# Altium project FPGA_interface.PrjPcb
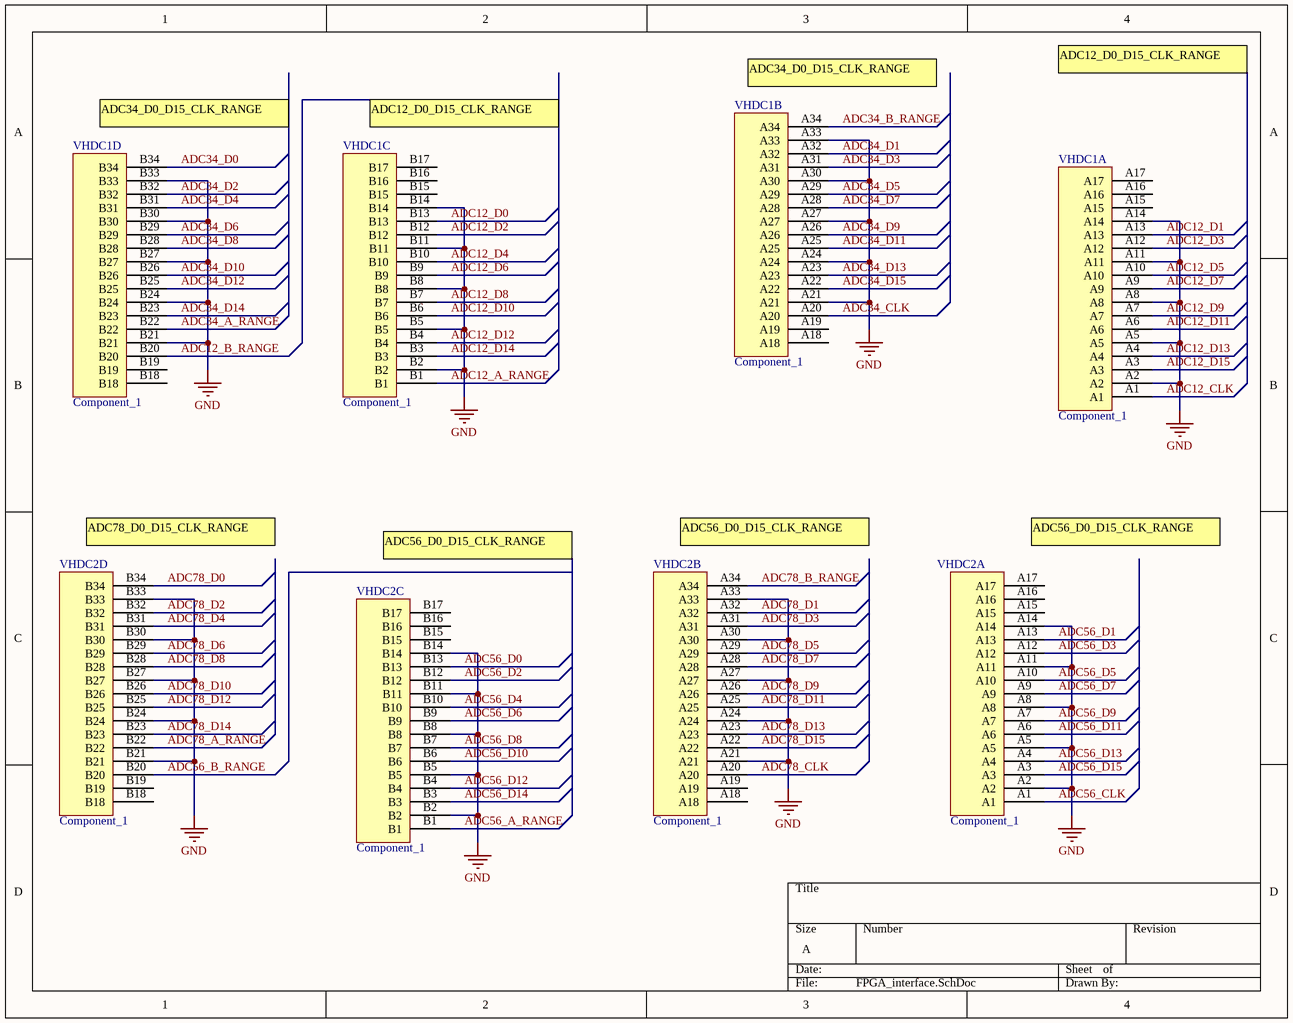
[diagram p0: FPGA_interface.SchDoc]
5 sheets, 18 parts. Net scope: global (net labels, ports and power ports of the same name join across sheets).
Board file: FPGA_interface_ver2.PcbDoc
Sheets:
  FPGA_interface.SchDoc
  Ch1and2.SchDoc
  Ch3and4.SchDoc
  Ch5and6.SchDoc
  Ch7and8.SchDoc

## Sheet FPGA_interface.SchDoc
size A

### Parts
VHDC1  Component_1  [VHDCP-68-01-M-EM: PLUG]  (parts A,B,C,D of 4)
VHDC2  Component_1  [VHDCP-68-01-M-EM: PLUG]  (parts A,B,C,D of 4)

### Nets
GND: VHDC1.A2 VHDC1.A5 VHDC1.A8 VHDC1.A11 VHDC1.A14 VHDC1.A21 VHDC1.A24 VHDC1.A27 VHDC1.A30 VHDC1.A33 VHDC1.B2 VHDC1.B5 VHDC1.B8 VHDC1.B11 VHDC1.B14 VHDC1.B21 VHDC1.B24 VHDC1.B27 VHDC1.B30 VHDC1.B33 VHDC2.A2 VHDC2.A5 VHDC2.A8 VHDC2.A11 VHDC2.A14 VHDC2.A21 VHDC2.A24 VHDC2.A27 VHDC2.A30 VHDC2.A33 VHDC2.B2 VHDC2.B5 VHDC2.B8 VHDC2.B11 VHDC2.B14 VHDC2.B21 VHDC2.B24 VHDC2.B27 VHDC2.B30 VHDC2.B33
ADC12_A_RANGE: VHDC1.B1
ADC12_B_RANGE: VHDC1.B20
ADC12_CLK: VHDC1.A1
ADC12_D0: VHDC1.B13
ADC12_D1: VHDC1.A13
ADC12_D2: VHDC1.B12
ADC12_D3: VHDC1.A12
ADC12_D4: VHDC1.B10
ADC12_D5: VHDC1.A10
ADC12_D6: VHDC1.B9
ADC12_D7: VHDC1.A9
ADC12_D8: VHDC1.B7
ADC12_D9: VHDC1.A7
ADC12_D10: VHDC1.B6
ADC12_D11: VHDC1.A6
ADC12_D12: VHDC1.B4
ADC12_D13: VHDC1.A4
ADC12_D14: VHDC1.B3
ADC12_D15: VHDC1.A3
ADC34_A_RANGE: VHDC1.B22
ADC34_B_RANGE: VHDC1.A34
ADC34_CLK: VHDC1.A20
ADC34_D0: VHDC1.B34
ADC34_D1: VHDC1.A32
ADC34_D2: VHDC1.B32
ADC34_D3: VHDC1.A31
ADC34_D4: VHDC1.B31
ADC34_D5: VHDC1.A29
ADC34_D6: VHDC1.B29
ADC34_D7: VHDC1.A28
ADC34_D8: VHDC1.B28
ADC34_D9: VHDC1.A26
ADC34_D10: VHDC1.B26
ADC34_D11: VHDC1.A25
ADC34_D12: VHDC1.B25
ADC34_D13: VHDC1.A23
ADC34_D14: VHDC1.B23
ADC34_D15: VHDC1.A22
ADC56_A_RANGE: VHDC2.B1
ADC56_B_RANGE: VHDC2.B20
ADC56_CLK: VHDC2.A1
ADC56_D0: VHDC2.B13
ADC56_D1: VHDC2.A13
ADC56_D2: VHDC2.B12
ADC56_D3: VHDC2.A12
ADC56_D4: VHDC2.B10
ADC56_D5: VHDC2.A10
ADC56_D6: VHDC2.B9
ADC56_D7: VHDC2.A9
ADC56_D8: VHDC2.B7
ADC56_D9: VHDC2.A7
ADC56_D10: VHDC2.B6
ADC56_D11: VHDC2.A6
ADC56_D12: VHDC2.B4
ADC56_D13: VHDC2.A4
ADC56_D14: VHDC2.B3
ADC56_D15: VHDC2.A3
ADC78_A_RANGE: VHDC2.B22
ADC78_B_RANGE: VHDC2.A34
ADC78_CLK: VHDC2.A20
ADC78_D0: VHDC2.B34
ADC78_D1: VHDC2.A32
ADC78_D2: VHDC2.B32
ADC78_D3: VHDC2.A31
ADC78_D4: VHDC2.B31
ADC78_D5: VHDC2.A29
ADC78_D6: VHDC2.B29
ADC78_D7: VHDC2.A28
ADC78_D8: VHDC2.B28
ADC78_D9: VHDC2.A26
ADC78_D10: VHDC2.B26
ADC78_D11: VHDC2.A25
ADC78_D12: VHDC2.B25
ADC78_D13: VHDC2.A23
ADC78_D14: VHDC2.B23
ADC78_D15: VHDC2.A22

Not connected (* = marked no-connect by the designer): VHDC1 A15 A16 A17 A18 A19 B15 B16 B17 B18 B19; VHDC2 A15 A16 A17 A18 A19 B15 B16 B17 B18 B19

### Notes on the sheet
- (near VHDC1) ADC34_D0_D15_CLK_RANGE
- ADC12_D0_D15_CLK_RANGE
- (near VHDC1) ADC12_D0_D15_CLK_RANGE
- (near VHDC2) ADC78_D0_D15_CLK_RANGE
- ADC56_D0_D15_CLK_RANGE
- (near VHDC2) ADC56_D0_D15_CLK_RANGE

### Library data of the parts
VHDC1 VHDC2 = Component_1: VHDC_connector

## Sheet Ch1and2.SchDoc
size A
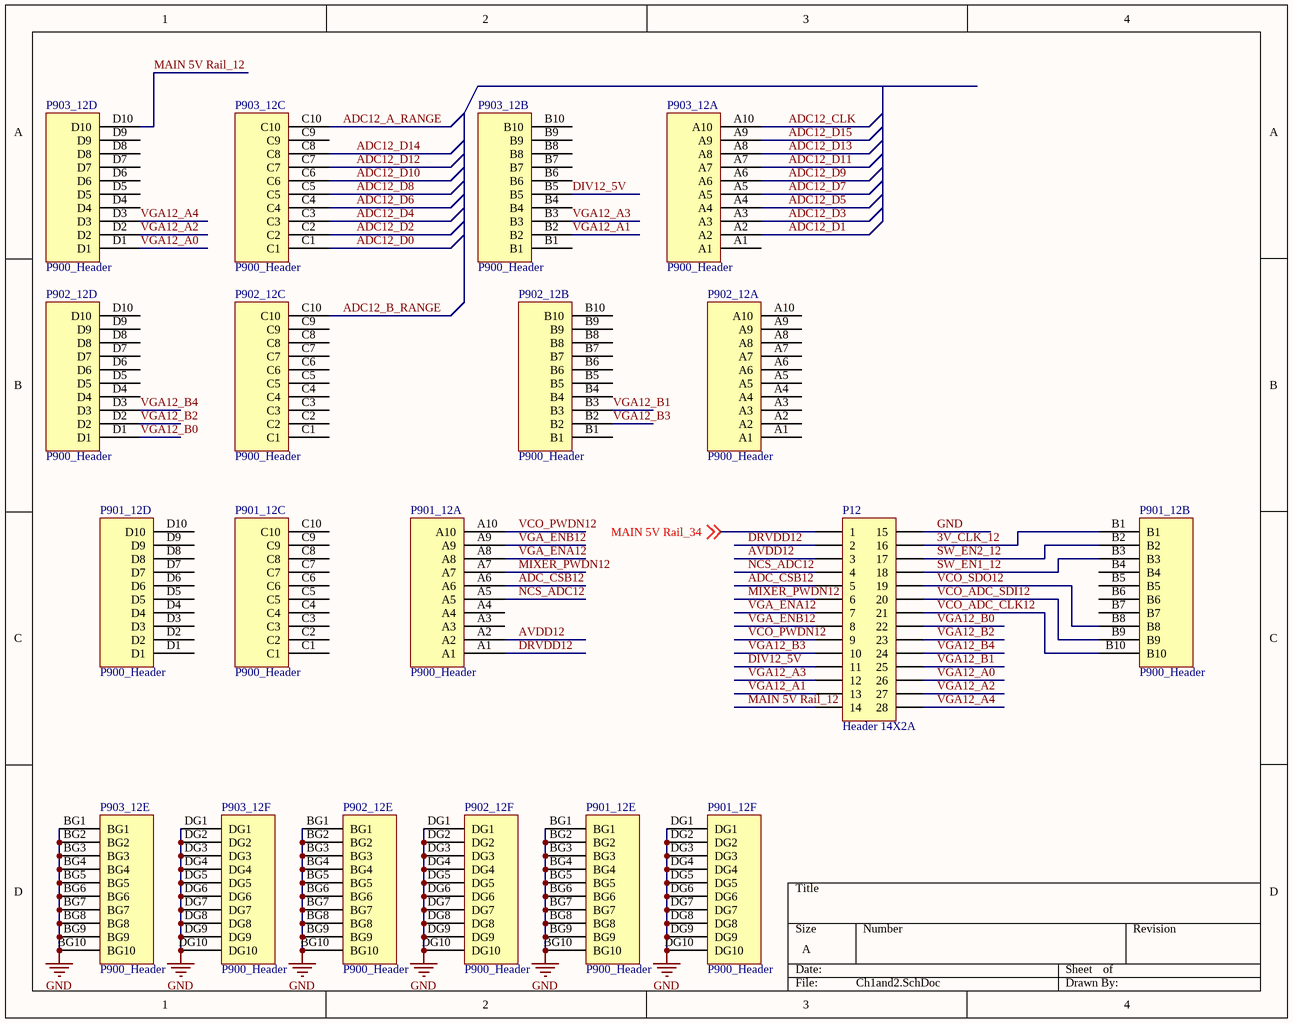
[diagram p1: Ch1and2.SchDoc]

### Parts
P12  Header 14X2A  [HDR2X14_CEN]
P901_12  P900_Header  [P900_header]  (parts A,B,C,D,E,F of 6)
P902_12  P900_Header  [P900_header]  (parts A,B,C,D,E,F of 6)
P903_12  P900_Header  [P900_header]  (parts A,B,C,D,E,F of 6)

### Nets
GND: P12.15 P901_12.BG1 P901_12.BG2 P901_12.BG3 P901_12.BG4 P901_12.BG5 P901_12.BG6 P901_12.BG7 P901_12.BG8 P901_12.BG9 P901_12.BG10 P901_12.DG1 P901_12.DG2 P901_12.DG3 P901_12.DG4 P901_12.DG5 P901_12.DG6 P901_12.DG7 P901_12.DG8 P901_12.DG9 P901_12.DG10 P902_12.BG1 P902_12.BG2 P902_12.BG3 P902_12.BG4 P902_12.BG5 P902_12.BG6 P902_12.BG7 P902_12.BG8 P902_12.BG9 P902_12.BG10 P902_12.DG1 P902_12.DG2 P902_12.DG3 P902_12.DG4 P902_12.DG5 P902_12.DG6 P902_12.DG7 P902_12.DG8 P902_12.DG9 P902_12.DG10 P903_12.BG1 P903_12.BG2 P903_12.BG3 P903_12.BG4 P903_12.BG5 P903_12.BG6 P903_12.BG7 P903_12.BG8 P903_12.BG9 P903_12.BG10 P903_12.DG1 P903_12.DG2 P903_12.DG3 P903_12.DG4 P903_12.DG5 P903_12.DG6 P903_12.DG7 P903_12.DG8 P903_12.DG9 P903_12.DG10
3V_CLK_12: P12.16 P901_12.B1
ADC12_A_RANGE: P903_12.C10
ADC12_B_RANGE: P902_12.C10
ADC12_CLK: P903_12.A10
ADC12_D0: P903_12.C1
ADC12_D1: P903_12.A2
ADC12_D2: P903_12.C2
ADC12_D3: P903_12.A3
ADC12_D4: P903_12.C3
ADC12_D5: P903_12.A4
ADC12_D6: P903_12.C4
ADC12_D7: P903_12.A5
ADC12_D8: P903_12.C5
ADC12_D9: P903_12.A6
ADC12_D10: P903_12.C6
ADC12_D11: P903_12.A7
ADC12_D12: P903_12.C7
ADC12_D13: P903_12.A8
ADC12_D14: P903_12.C8
ADC12_D15: P903_12.A9
ADC_CSB12: P12.5 P901_12.A6
AVDD12: P12.3 P901_12.A2
DIV12_5V: P12.11 P903_12.B5
DRVDD12: P12.2 P901_12.A1
MAIN 5V Rail_12: P12.14 P903_12.D10
MAIN 5V Rail_34: P12.1 ; off-sheet MAIN 5V Rail_34
MIXER_PWDN12: P12.6 P901_12.A7
NCS_ADC12: P12.4 P901_12.A5
SW_EN1_12: P12.18 P901_12.B3
SW_EN2_12: P12.17 P901_12.B2
VCO_ADC_CLK12: P12.21 P901_12.B10
VCO_ADC_SDI12: P12.20 P901_12.B9
VCO_PWDN12: P12.9 P901_12.A10
VCO_SDO12: P12.19 P901_12.B8
VGA12_A0: P12.26 P903_12.D1
VGA12_A1: P12.13 P903_12.B2
VGA12_A2: P12.27 P903_12.D2
VGA12_A3: P12.12 P903_12.B3
VGA12_A4: P12.28 P903_12.D3
VGA12_B0: P12.22 P902_12.D1
VGA12_B1: P12.25 P902_12.B3
VGA12_B2: P12.23 P902_12.D2
VGA12_B3: P12.10 P902_12.B2
VGA12_B4: P12.24 P902_12.D3
VGA_ENA12: P12.7 P901_12.A8
VGA_ENB12: P12.8 P901_12.A9

Not connected (* = marked no-connect by the designer): P901_12 A3 A4 B4 B5 B6 B7 C1 C2 C3 C4 C5 C6 C7 C8 C9 C10 D1 D2 D3 D4 D5 D6 D7 D8 D9 D10; P902_12 A1 A2 A3 A4 A5 A6 A7 A8 A9 A10 B1 B4 B5 B6 B7 B8 B9 B10 C1 C2 C3 C4 C5 C6 C7 C8 C9 D4 D5 D6 D7 D8 D9 D10; P903_12 A1 B1 B4 B6 B7 B8 B9 B10 C9 D4 D5 D6 D7 D8 D9

### Library data of the parts
P12 = Header 14X2A: Header, 14-Pin, Dual row; LatestRevisionDate: 17-Jul-2002; LatestRevisionNote: Re-released for DXP Platform.; Publisher: Altium Limited
P902_12 P903_12 = P900_Header: pin to pad: A1>ADC

## Sheet Ch3and4.SchDoc
size A
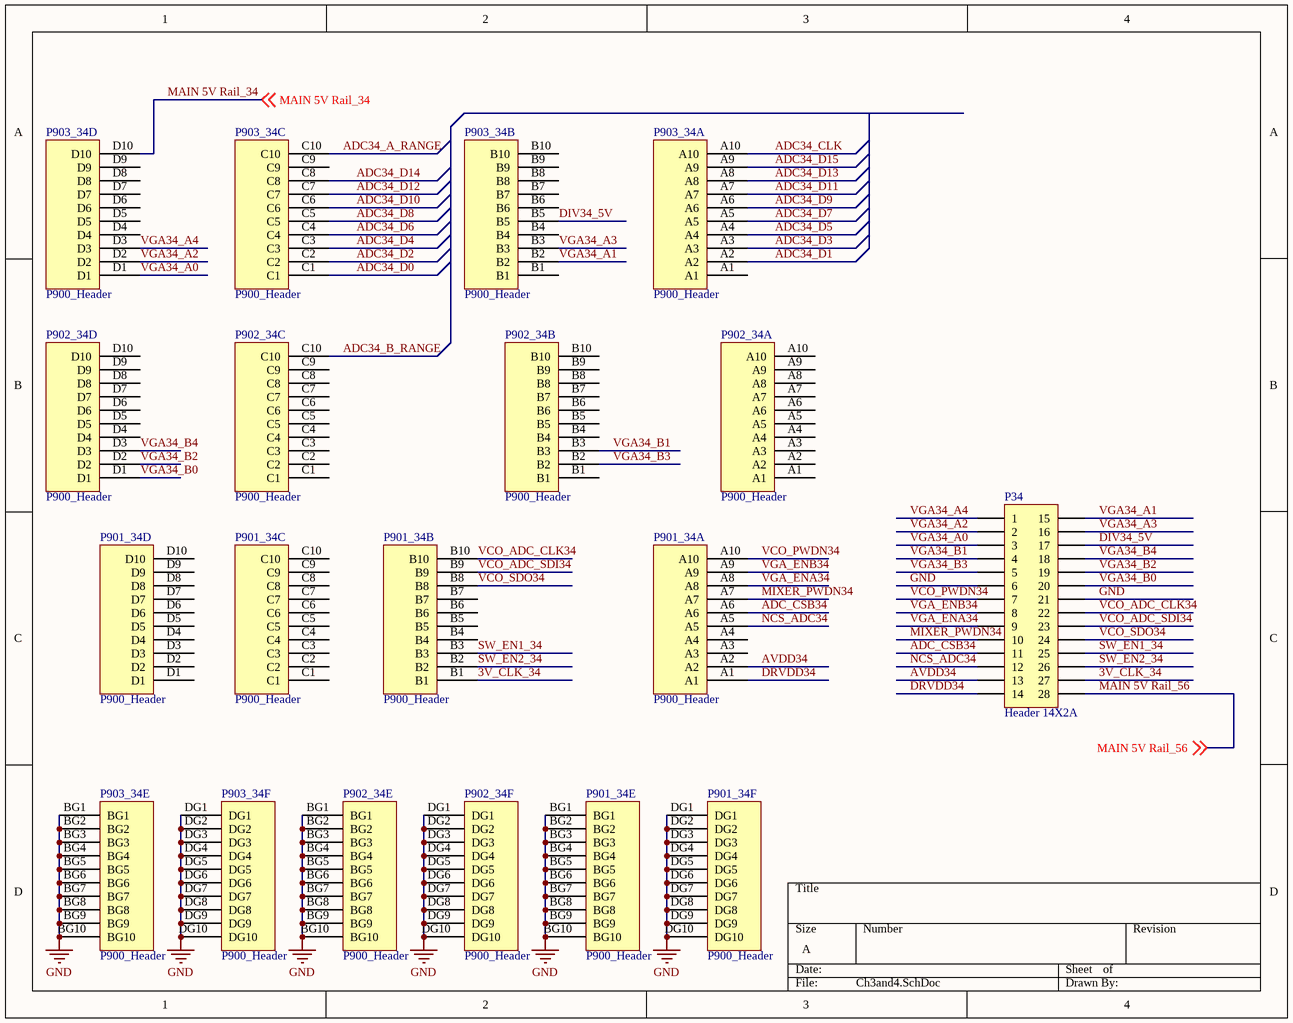
[diagram p2: Ch3and4.SchDoc]

### Parts
P34  Header 14X2A  [HDR2X14_CEN]
P901_34  P900_Header  [P900_header]  (parts A,B,C,D,E,F of 6)
P902_34  P900_Header  [P900_header]  (parts A,B,C,D,E,F of 6)
P903_34  P900_Header  [P900_header]  (parts A,B,C,D,E,F of 6)

### Nets
GND: P34.6 P34.21 P901_34.BG1 P901_34.BG2 P901_34.BG3 P901_34.BG4 P901_34.BG5 P901_34.BG6 P901_34.BG7 P901_34.BG8 P901_34.BG9 P901_34.BG10 P901_34.DG1 P901_34.DG2 P901_34.DG3 P901_34.DG4 P901_34.DG5 P901_34.DG6 P901_34.DG7 P901_34.DG8 P901_34.DG9 P901_34.DG10 P902_34.BG1 P902_34.BG2 P902_34.BG3 P902_34.BG4 P902_34.BG5 P902_34.BG6 P902_34.BG7 P902_34.BG8 P902_34.BG9 P902_34.BG10 P902_34.DG1 P902_34.DG2 P902_34.DG3 P902_34.DG4 P902_34.DG5 P902_34.DG6 P902_34.DG7 P902_34.DG8 P902_34.DG9 P902_34.DG10 P903_34.BG1 P903_34.BG2 P903_34.BG3 P903_34.BG4 P903_34.BG5 P903_34.BG6 P903_34.BG7 P903_34.BG8 P903_34.BG9 P903_34.BG10 P903_34.DG1 P903_34.DG2 P903_34.DG3 P903_34.DG4 P903_34.DG5 P903_34.DG6 P903_34.DG7 P903_34.DG8 P903_34.DG9 P903_34.DG10
3V_CLK_34: P34.27 P901_34.B1
ADC34_A_RANGE: P903_34.C10
ADC34_B_RANGE: P902_34.C10
ADC34_CLK: P903_34.A10
ADC34_D0: P903_34.C1
ADC34_D1: P903_34.A2
ADC34_D2: P903_34.C2
ADC34_D3: P903_34.A3
ADC34_D4: P903_34.C3
ADC34_D5: P903_34.A4
ADC34_D6: P903_34.C4
ADC34_D7: P903_34.A5
ADC34_D8: P903_34.C5
ADC34_D9: P903_34.A6
ADC34_D10: P903_34.C6
ADC34_D11: P903_34.A7
ADC34_D12: P903_34.C7
ADC34_D13: P903_34.A8
ADC34_D14: P903_34.C8
ADC34_D15: P903_34.A9
ADC_CSB34: P34.11 P901_34.A6
AVDD34: P34.13 P901_34.A2
DIV34_5V: P34.17 P903_34.B5
DRVDD34: P34.14 P901_34.A1
MAIN 5V Rail_34: P903_34.D10 ; off-sheet MAIN 5V Rail_34
MAIN 5V Rail_56: P34.28 ; off-sheet MAIN 5V Rail_56
MIXER_PWDN34: P34.10 P901_34.A7
NCS_ADC34: P34.12 P901_34.A5
SW_EN1_34: P34.25 P901_34.B3
SW_EN2_34: P34.26 P901_34.B2
VCO_ADC_CLK34: P34.22 P901_34.B10
VCO_ADC_SDI34: P34.23 P901_34.B9
VCO_PWDN34: P34.7 P901_34.A10
VCO_SDO34: P34.24 P901_34.B8
VGA34_A0: P34.3 P903_34.D1
VGA34_A1: P34.15 P903_34.B2
VGA34_A2: P34.2 P903_34.D2
VGA34_A3: P34.16 P903_34.B3
VGA34_A4: P34.1 P903_34.D3
VGA34_B0: P34.20 P902_34.D1
VGA34_B1: P34.4 P902_34.B3
VGA34_B2: P34.19 P902_34.D2
VGA34_B3: P34.5 P902_34.B2
VGA34_B4: P34.18 P902_34.D3
VGA_ENA34: P34.9 P901_34.A8
VGA_ENB34: P34.8 P901_34.A9

Not connected (* = marked no-connect by the designer): P901_34 A3 A4 B4 B5 B6 B7 C1 C2 C3 C4 C5 C6 C7 C8 C9 C10 D1 D2 D3 D4 D5 D6 D7 D8 D9 D10; P902_34 A1 A2 A3 A4 A5 A6 A7 A8 A9 A10 B1 B4 B5 B6 B7 B8 B9 B10 C1 C2 C3 C4 C5 C6 C7 C8 C9 D4 D5 D6 D7 D8 D9 D10; P903_34 A1 B1 B4 B6 B7 B8 B9 B10 C9 D4 D5 D6 D7 D8 D9

### Library data of the parts
P34 = Header 14X2A: Header, 14-Pin, Dual row; LatestRevisionDate: 17-Jul-2002; LatestRevisionNote: Re-released for DXP Platform.; Publisher: Altium Limited
P902_34 P903_34 = P900_Header: pin to pad: A1>ADC

## Sheet Ch5and6.SchDoc
size A
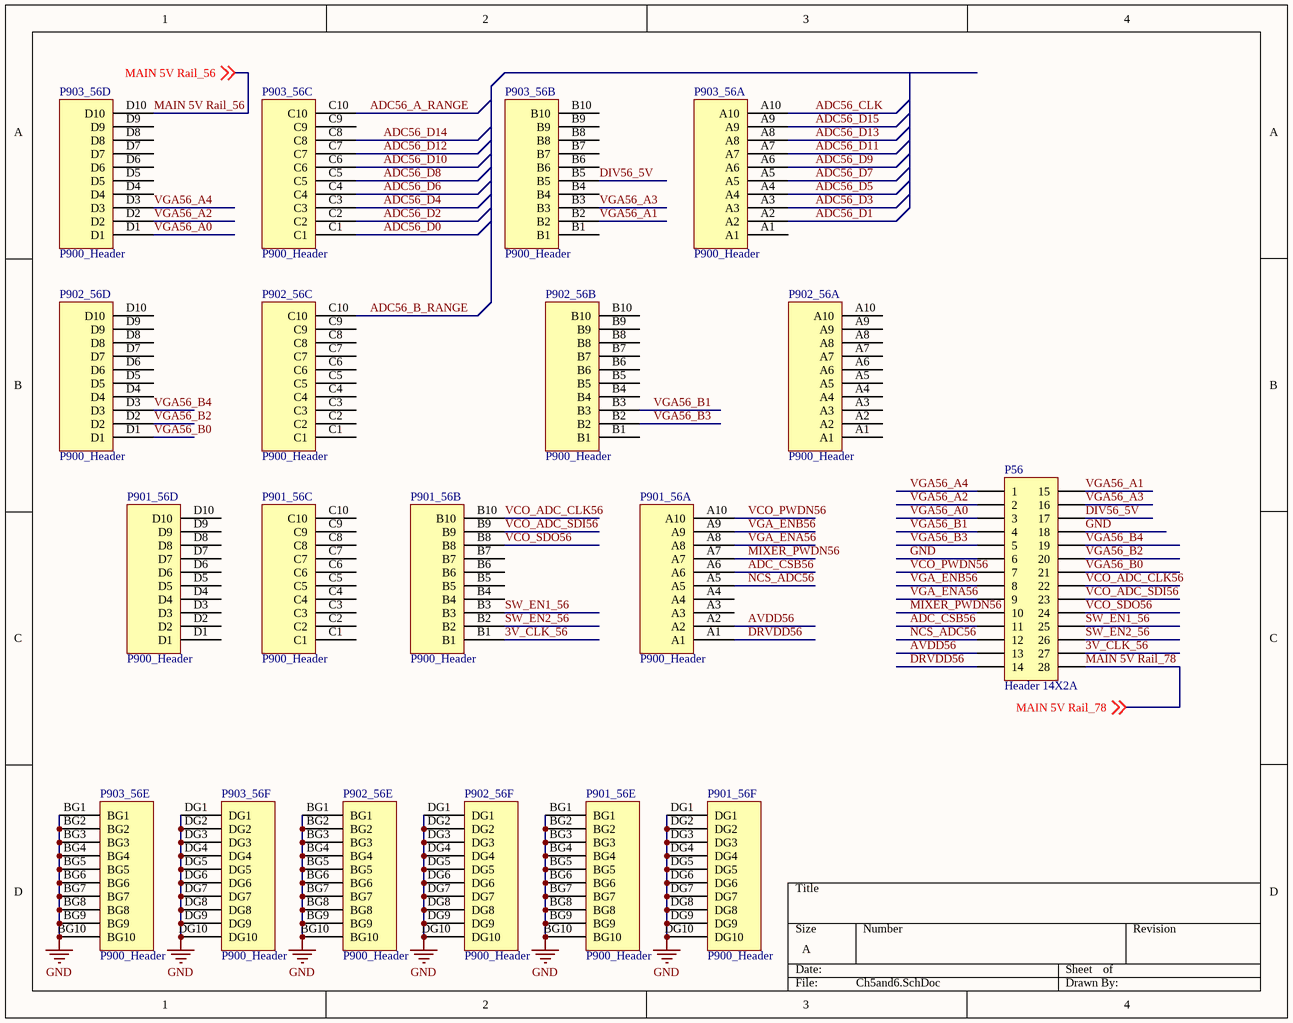
[diagram p3: Ch5and6.SchDoc]

### Parts
P56  Header 14X2A  [HDR2X14_CEN]
P901_56  P900_Header  [P900_header]  (parts A,B,C,D,E,F of 6)
P902_56  P900_Header  [P900_header]  (parts A,B,C,D,E,F of 6)
P903_56  P900_Header  [P900_header]  (parts A,B,C,D,E,F of 6)

### Nets
GND: P56.6 P56.18 P901_56.BG1 P901_56.BG2 P901_56.BG3 P901_56.BG4 P901_56.BG5 P901_56.BG6 P901_56.BG7 P901_56.BG8 P901_56.BG9 P901_56.BG10 P901_56.DG1 P901_56.DG2 P901_56.DG3 P901_56.DG4 P901_56.DG5 P901_56.DG6 P901_56.DG7 P901_56.DG8 P901_56.DG9 P901_56.DG10 P902_56.BG1 P902_56.BG2 P902_56.BG3 P902_56.BG4 P902_56.BG5 P902_56.BG6 P902_56.BG7 P902_56.BG8 P902_56.BG9 P902_56.BG10 P902_56.DG1 P902_56.DG2 P902_56.DG3 P902_56.DG4 P902_56.DG5 P902_56.DG6 P902_56.DG7 P902_56.DG8 P902_56.DG9 P902_56.DG10 P903_56.BG1 P903_56.BG2 P903_56.BG3 P903_56.BG4 P903_56.BG5 P903_56.BG6 P903_56.BG7 P903_56.BG8 P903_56.BG9 P903_56.BG10 P903_56.DG1 P903_56.DG2 P903_56.DG3 P903_56.DG4 P903_56.DG5 P903_56.DG6 P903_56.DG7 P903_56.DG8 P903_56.DG9 P903_56.DG10
3V_CLK_56: P56.27 P901_56.B1
ADC56_A_RANGE: P903_56.C10
ADC56_B_RANGE: P902_56.C10
ADC56_CLK: P903_56.A10
ADC56_D0: P903_56.C1
ADC56_D1: P903_56.A2
ADC56_D2: P903_56.C2
ADC56_D3: P903_56.A3
ADC56_D4: P903_56.C3
ADC56_D5: P903_56.A4
ADC56_D6: P903_56.C4
ADC56_D7: P903_56.A5
ADC56_D8: P903_56.C5
ADC56_D9: P903_56.A6
ADC56_D10: P903_56.C6
ADC56_D11: P903_56.A7
ADC56_D12: P903_56.C7
ADC56_D13: P903_56.A8
ADC56_D14: P903_56.C8
ADC56_D15: P903_56.A9
ADC_CSB56: P56.11 P901_56.A6
AVDD56: P56.13 P901_56.A2
DIV56_5V: P56.17 P903_56.B5
DRVDD56: P56.14 P901_56.A1
MAIN 5V Rail_56: P903_56.D10 ; off-sheet MAIN 5V Rail_56
MAIN 5V Rail_78: P56.28 ; off-sheet MAIN 5V Rail_78
MIXER_PWDN56: P56.10 P901_56.A7
NCS_ADC56: P56.12 P901_56.A5
SW_EN1_56: P56.25 P901_56.B3
SW_EN2_56: P56.26 P901_56.B2
VCO_ADC_CLK56: P56.22 P901_56.B10
VCO_ADC_SDI56: P56.23 P901_56.B9
VCO_PWDN56: P56.7 P901_56.A10
VCO_SDO56: P56.24 P901_56.B8
VGA56_A0: P56.3 P903_56.D1
VGA56_A1: P56.15 P903_56.B2
VGA56_A2: P56.2 P903_56.D2
VGA56_A3: P56.16 P903_56.B3
VGA56_A4: P56.1 P903_56.D3
VGA56_B0: P56.21 P902_56.D1
VGA56_B1: P56.4 P902_56.B3
VGA56_B2: P56.20 P902_56.D2
VGA56_B3: P56.5 P902_56.B2
VGA56_B4: P56.19 P902_56.D3
VGA_ENA56: P56.9 P901_56.A8
VGA_ENB56: P56.8 P901_56.A9

Not connected (* = marked no-connect by the designer): P901_56 A3 A4 B4 B5 B6 B7 C1 C2 C3 C4 C5 C6 C7 C8 C9 C10 D1 D2 D3 D4 D5 D6 D7 D8 D9 D10; P902_56 A1 A2 A3 A4 A5 A6 A7 A8 A9 A10 B1 B4 B5 B6 B7 B8 B9 B10 C1 C2 C3 C4 C5 C6 C7 C8 C9 D4 D5 D6 D7 D8 D9 D10; P903_56 A1 B1 B4 B6 B7 B8 B9 B10 C9 D4 D5 D6 D7 D8 D9

### Library data of the parts
P56 = Header 14X2A: Header, 14-Pin, Dual row; LatestRevisionDate: 17-Jul-2002; LatestRevisionNote: Re-released for DXP Platform.; Publisher: Altium Limited
P902_56 P903_56 = P900_Header: pin to pad: A1>ADC

## Sheet Ch7and8.SchDoc
size A
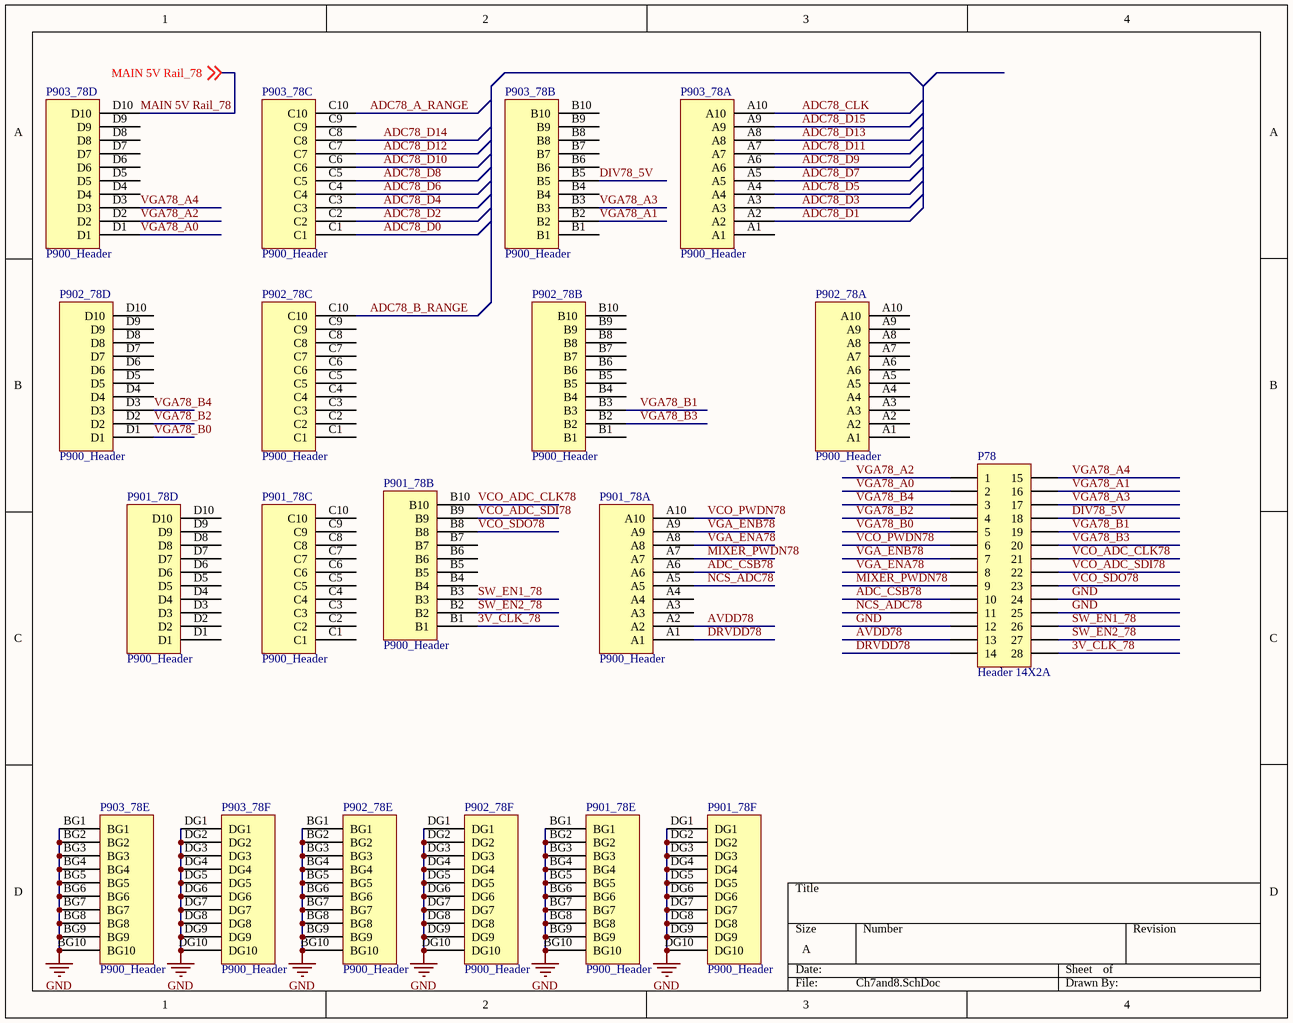
[diagram p4: Ch7and8.SchDoc]

### Parts
P78  Header 14X2A  [HDR2X14_CEN]
P901_78  P900_Header  [P900_header]  (parts A,B,C,D,E,F of 6)
P902_78  P900_Header  [P900_header]  (parts A,B,C,D,E,F of 6)
P903_78  P900_Header  [P900_header]  (parts A,B,C,D,E,F of 6)

### Nets
GND: P78.12 P78.24 P78.25 P901_78.BG1 P901_78.BG2 P901_78.BG3 P901_78.BG4 P901_78.BG5 P901_78.BG6 P901_78.BG7 P901_78.BG8 P901_78.BG9 P901_78.BG10 P901_78.DG1 P901_78.DG2 P901_78.DG3 P901_78.DG4 P901_78.DG5 P901_78.DG6 P901_78.DG7 P901_78.DG8 P901_78.DG9 P901_78.DG10 P902_78.BG1 P902_78.BG2 P902_78.BG3 P902_78.BG4 P902_78.BG5 P902_78.BG6 P902_78.BG7 P902_78.BG8 P902_78.BG9 P902_78.BG10 P902_78.DG1 P902_78.DG2 P902_78.DG3 P902_78.DG4 P902_78.DG5 P902_78.DG6 P902_78.DG7 P902_78.DG8 P902_78.DG9 P902_78.DG10 P903_78.BG1 P903_78.BG2 P903_78.BG3 P903_78.BG4 P903_78.BG5 P903_78.BG6 P903_78.BG7 P903_78.BG8 P903_78.BG9 P903_78.BG10 P903_78.DG1 P903_78.DG2 P903_78.DG3 P903_78.DG4 P903_78.DG5 P903_78.DG6 P903_78.DG7 P903_78.DG8 P903_78.DG9 P903_78.DG10
3V_CLK_78: P78.28 P901_78.B1
ADC78_A_RANGE: P903_78.C10
ADC78_B_RANGE: P902_78.C10
ADC78_CLK: P903_78.A10
ADC78_D0: P903_78.C1
ADC78_D1: P903_78.A2
ADC78_D2: P903_78.C2
ADC78_D3: P903_78.A3
ADC78_D4: P903_78.C3
ADC78_D5: P903_78.A4
ADC78_D6: P903_78.C4
ADC78_D7: P903_78.A5
ADC78_D8: P903_78.C5
ADC78_D9: P903_78.A6
ADC78_D10: P903_78.C6
ADC78_D11: P903_78.A7
ADC78_D12: P903_78.C7
ADC78_D13: P903_78.A8
ADC78_D14: P903_78.C8
ADC78_D15: P903_78.A9
ADC_CSB78: P78.10 P901_78.A6
AVDD78: P78.13 P901_78.A2
DIV78_5V: P78.18 P903_78.B5
DRVDD78: P78.14 P901_78.A1
MAIN 5V Rail_78: P903_78.D10 ; off-sheet MAIN 5V Rail_78
MIXER_PWDN78: P78.9 P901_78.A7
NCS_ADC78: P78.11 P901_78.A5
SW_EN1_78: P78.26 P901_78.B3
SW_EN2_78: P78.27 P901_78.B2
VCO_ADC_CLK78: P78.21 P901_78.B10
VCO_ADC_SDI78: P78.22 P901_78.B9
VCO_PWDN78: P78.6 P901_78.A10
VCO_SDO78: P78.23 P901_78.B8
VGA78_A0: P78.2 P903_78.D1
VGA78_A1: P78.16 P903_78.B2
VGA78_A2: P78.1 P903_78.D2
VGA78_A3: P78.17 P903_78.B3
VGA78_A4: P78.15 P903_78.D3
VGA78_B0: P78.5 P902_78.D1
VGA78_B1: P78.19 P902_78.B3
VGA78_B2: P78.4 P902_78.D2
VGA78_B3: P78.20 P902_78.B2
VGA78_B4: P78.3 P902_78.D3
VGA_ENA78: P78.8 P901_78.A8
VGA_ENB78: P78.7 P901_78.A9

Not connected (* = marked no-connect by the designer): P901_78 A3 A4 B4 B5 B6 B7 C1 C2 C3 C4 C5 C6 C7 C8 C9 C10 D1 D2 D3 D4 D5 D6 D7 D8 D9 D10; P902_78 A1 A2 A3 A4 A5 A6 A7 A8 A9 A10 B1 B4 B5 B6 B7 B8 B9 B10 C1 C2 C3 C4 C5 C6 C7 C8 C9 D4 D5 D6 D7 D8 D9 D10; P903_78 A1 B1 B4 B6 B7 B8 B9 B10 C9 D4 D5 D6 D7 D8 D9

### Library data of the parts
P78 = Header 14X2A: Header, 14-Pin, Dual row; LatestRevisionDate: 17-Jul-2002; LatestRevisionNote: Re-released for DXP Platform.; Publisher: Altium Limited
P902_78 P903_78 = P900_Header: pin to pad: A1>ADC

## Nets that join several sheets
GND: FPGA_interface (40 pins), Ch1and2 (61 pins), Ch3and4 (62 pins), Ch5and6 (62 pins), Ch7and8 (63 pins)
ADC12_A_RANGE: FPGA_interface (VHDC1.B1), Ch1and2 (P903_12.C10)
ADC12_B_RANGE: FPGA_interface (VHDC1.B20), Ch1and2 (P902_12.C10)
ADC12_CLK: FPGA_interface (VHDC1.A1), Ch1and2 (P903_12.A10)
ADC12_D0: FPGA_interface (VHDC1.B13), Ch1and2 (P903_12.C1)
ADC12_D1: FPGA_interface (VHDC1.A13), Ch1and2 (P903_12.A2)
ADC12_D2: FPGA_interface (VHDC1.B12), Ch1and2 (P903_12.C2)
ADC12_D3: FPGA_interface (VHDC1.A12), Ch1and2 (P903_12.A3)
ADC12_D4: FPGA_interface (VHDC1.B10), Ch1and2 (P903_12.C3)
ADC12_D5: FPGA_interface (VHDC1.A10), Ch1and2 (P903_12.A4)
ADC12_D6: FPGA_interface (VHDC1.B9), Ch1and2 (P903_12.C4)
ADC12_D7: FPGA_interface (VHDC1.A9), Ch1and2 (P903_12.A5)
ADC12_D8: FPGA_interface (VHDC1.B7), Ch1and2 (P903_12.C5)
ADC12_D9: FPGA_interface (VHDC1.A7), Ch1and2 (P903_12.A6)
ADC12_D10: FPGA_interface (VHDC1.B6), Ch1and2 (P903_12.C6)
ADC12_D11: FPGA_interface (VHDC1.A6), Ch1and2 (P903_12.A7)
ADC12_D12: FPGA_interface (VHDC1.B4), Ch1and2 (P903_12.C7)
ADC12_D13: FPGA_interface (VHDC1.A4), Ch1and2 (P903_12.A8)
ADC12_D14: FPGA_interface (VHDC1.B3), Ch1and2 (P903_12.C8)
ADC12_D15: FPGA_interface (VHDC1.A3), Ch1and2 (P903_12.A9)
ADC34_A_RANGE: FPGA_interface (VHDC1.B22), Ch3and4 (P903_34.C10)
ADC34_B_RANGE: FPGA_interface (VHDC1.A34), Ch3and4 (P902_34.C10)
ADC34_CLK: FPGA_interface (VHDC1.A20), Ch3and4 (P903_34.A10)
ADC34_D0: FPGA_interface (VHDC1.B34), Ch3and4 (P903_34.C1)
ADC34_D1: FPGA_interface (VHDC1.A32), Ch3and4 (P903_34.A2)
ADC34_D2: FPGA_interface (VHDC1.B32), Ch3and4 (P903_34.C2)
ADC34_D3: FPGA_interface (VHDC1.A31), Ch3and4 (P903_34.A3)
ADC34_D4: FPGA_interface (VHDC1.B31), Ch3and4 (P903_34.C3)
ADC34_D5: FPGA_interface (VHDC1.A29), Ch3and4 (P903_34.A4)
ADC34_D6: FPGA_interface (VHDC1.B29), Ch3and4 (P903_34.C4)
ADC34_D7: FPGA_interface (VHDC1.A28), Ch3and4 (P903_34.A5)
ADC34_D8: FPGA_interface (VHDC1.B28), Ch3and4 (P903_34.C5)
ADC34_D9: FPGA_interface (VHDC1.A26), Ch3and4 (P903_34.A6)
ADC34_D10: FPGA_interface (VHDC1.B26), Ch3and4 (P903_34.C6)
ADC34_D11: FPGA_interface (VHDC1.A25), Ch3and4 (P903_34.A7)
ADC34_D12: FPGA_interface (VHDC1.B25), Ch3and4 (P903_34.C7)
ADC34_D13: FPGA_interface (VHDC1.A23), Ch3and4 (P903_34.A8)
ADC34_D14: FPGA_interface (VHDC1.B23), Ch3and4 (P903_34.C8)
ADC34_D15: FPGA_interface (VHDC1.A22), Ch3and4 (P903_34.A9)
ADC56_A_RANGE: FPGA_interface (VHDC2.B1), Ch5and6 (P903_56.C10)
ADC56_B_RANGE: FPGA_interface (VHDC2.B20), Ch5and6 (P902_56.C10)
ADC56_CLK: FPGA_interface (VHDC2.A1), Ch5and6 (P903_56.A10)
ADC56_D0: FPGA_interface (VHDC2.B13), Ch5and6 (P903_56.C1)
ADC56_D1: FPGA_interface (VHDC2.A13), Ch5and6 (P903_56.A2)
ADC56_D2: FPGA_interface (VHDC2.B12), Ch5and6 (P903_56.C2)
ADC56_D3: FPGA_interface (VHDC2.A12), Ch5and6 (P903_56.A3)
ADC56_D4: FPGA_interface (VHDC2.B10), Ch5and6 (P903_56.C3)
ADC56_D5: FPGA_interface (VHDC2.A10), Ch5and6 (P903_56.A4)
ADC56_D6: FPGA_interface (VHDC2.B9), Ch5and6 (P903_56.C4)
ADC56_D7: FPGA_interface (VHDC2.A9), Ch5and6 (P903_56.A5)
ADC56_D8: FPGA_interface (VHDC2.B7), Ch5and6 (P903_56.C5)
ADC56_D9: FPGA_interface (VHDC2.A7), Ch5and6 (P903_56.A6)
ADC56_D10: FPGA_interface (VHDC2.B6), Ch5and6 (P903_56.C6)
ADC56_D11: FPGA_interface (VHDC2.A6), Ch5and6 (P903_56.A7)
ADC56_D12: FPGA_interface (VHDC2.B4), Ch5and6 (P903_56.C7)
ADC56_D13: FPGA_interface (VHDC2.A4), Ch5and6 (P903_56.A8)
ADC56_D14: FPGA_interface (VHDC2.B3), Ch5and6 (P903_56.C8)
ADC56_D15: FPGA_interface (VHDC2.A3), Ch5and6 (P903_56.A9)
ADC78_A_RANGE: FPGA_interface (VHDC2.B22), Ch7and8 (P903_78.C10)
ADC78_B_RANGE: FPGA_interface (VHDC2.A34), Ch7and8 (P902_78.C10)
ADC78_CLK: FPGA_interface (VHDC2.A20), Ch7and8 (P903_78.A10)
ADC78_D0: FPGA_interface (VHDC2.B34), Ch7and8 (P903_78.C1)
ADC78_D1: FPGA_interface (VHDC2.A32), Ch7and8 (P903_78.A2)
ADC78_D2: FPGA_interface (VHDC2.B32), Ch7and8 (P903_78.C2)
ADC78_D3: FPGA_interface (VHDC2.A31), Ch7and8 (P903_78.A3)
ADC78_D4: FPGA_interface (VHDC2.B31), Ch7and8 (P903_78.C3)
ADC78_D5: FPGA_interface (VHDC2.A29), Ch7and8 (P903_78.A4)
ADC78_D6: FPGA_interface (VHDC2.B29), Ch7and8 (P903_78.C4)
ADC78_D7: FPGA_interface (VHDC2.A28), Ch7and8 (P903_78.A5)
ADC78_D8: FPGA_interface (VHDC2.B28), Ch7and8 (P903_78.C5)
ADC78_D9: FPGA_interface (VHDC2.A26), Ch7and8 (P903_78.A6)
ADC78_D10: FPGA_interface (VHDC2.B26), Ch7and8 (P903_78.C6)
ADC78_D11: FPGA_interface (VHDC2.A25), Ch7and8 (P903_78.A7)
ADC78_D12: FPGA_interface (VHDC2.B25), Ch7and8 (P903_78.C7)
ADC78_D13: FPGA_interface (VHDC2.A23), Ch7and8 (P903_78.A8)
ADC78_D14: FPGA_interface (VHDC2.B23), Ch7and8 (P903_78.C8)
ADC78_D15: FPGA_interface (VHDC2.A22), Ch7and8 (P903_78.A9)
MAIN 5V Rail_34: Ch1and2 (P12.1), Ch3and4 (P903_34.D10)
MAIN 5V Rail_56: Ch3and4 (P34.28), Ch5and6 (P903_56.D10)
MAIN 5V Rail_78: Ch5and6 (P56.28), Ch7and8 (P903_78.D10)